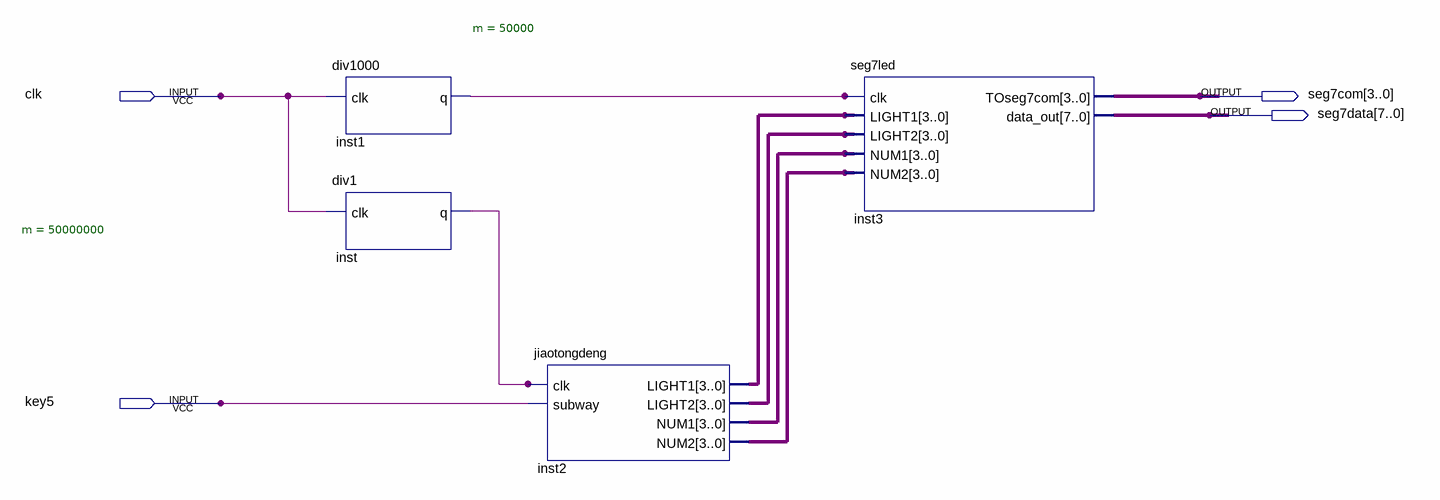
[diagram p0: schematic sheet]
// Quartus schematic traffic.bdf as structural Verilog: 4 symbols, 4 pins
module traffic (
  input  clk,
  input  key5,
  output [3:0] seg7com,
  output [7:0] seg7data
);

  wire inst1_q, inst_q;
  wire [3:0] inst2_light1, inst2_light2, inst2_num1, inst2_num2;

  div1000 #(.m(50000)) inst1 (.clk(clk), .q(inst1_q));
  div1 #(.m(50000000)) inst (.clk(clk), .q(inst_q));
  jiaotongdeng inst2 (
    .clk(inst_q), .subway(key5), .LIGHT1(inst2_light1), .LIGHT2(inst2_light2), .NUM1(inst2_num1),
    .NUM2(inst2_num2));
  seg7led inst3 (
    .clk(inst1_q), .LIGHT1(inst2_light1), .LIGHT2(inst2_light2), .NUM1(inst2_num1), .NUM2(inst2_num2),
    .TOseg7com(seg7com), .data_out(seg7data));
endmodule
